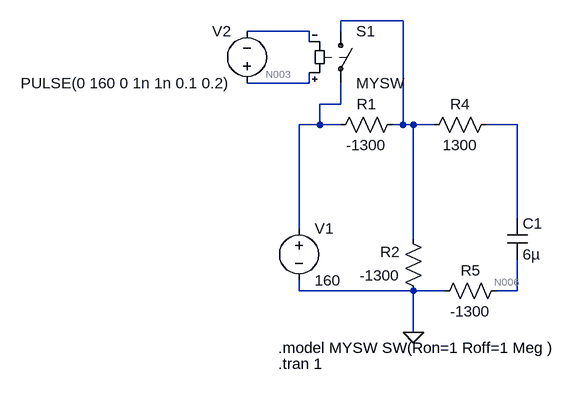
[diagram p0: schematic расчетная работа2.asc]
расчетная работа2.asc, the LTspice schematic file:
Version 4
SHEET 1 880 680
WIRE 176 -144 80 -144
WIRE 32 -128 -64 -128
WIRE 80 -128 80 -144
WIRE 32 -112 32 -128
WIRE 32 -48 32 -64
WIRE 32 -48 -64 -48
WIRE 80 -16 80 -48
WIRE 80 -16 48 -16
WIRE 48 16 48 -16
WIRE 48 16 16 16
WIRE 80 16 48 16
WIRE 176 16 176 -144
WIRE 176 16 160 16
WIRE 192 16 176 16
WIRE 224 16 192 16
WIRE 352 16 304 16
WIRE 352 160 352 16
WIRE 16 176 16 16
WIRE 192 192 192 16
WIRE 16 272 16 256
WIRE 192 272 16 272
WIRE 240 272 192 272
WIRE 352 272 352 224
WIRE 352 272 320 272
WIRE 192 336 192 272
FLAG 192 336 0
SYMBOL res 176 0 R90
WINDOW 0 0 56 VBottom 2
WINDOW 3 32 56 VTop 2
SYMATTR InstName R1
SYMATTR Value -1300
SYMBOL res 208 288 R180
WINDOW 0 36 76 Left 2
WINDOW 3 36 40 Left 2
SYMATTR InstName R2
SYMATTR Value -1300
SYMBOL res 208 32 R270
WINDOW 0 32 56 VTop 2
WINDOW 3 0 56 VBottom 2
SYMATTR InstName R4
SYMATTR Value 1300
SYMBOL res 224 288 R270
WINDOW 0 32 56 VTop 2
WINDOW 3 0 56 VBottom 2
SYMATTR InstName R5
SYMATTR Value -1300
SYMBOL cap 336 160 R0
SYMATTR InstName C1
SYMATTR Value 6µ
SYMBOL voltage 16 160 R0
SYMATTR InstName V1
SYMATTR Value 160
SYMBOL sw 80 -144 R0
SYMATTR InstName S1
SYMATTR Value MYSW
SYMBOL voltage -64 -32 R180
WINDOW 0 24 96 Left 2
WINDOW 3 24 16 Left 2
WINDOW 123 0 0 Left 0
WINDOW 39 0 0 Left 0
SYMATTR InstName V2
SYMATTR Value PULSE(0 160 0 1n 1n 0.1 0.2)
TEXT -16 360 Left 2 !.model MYSW SW(Ron=1 Roff=1 Meg )
TEXT -16 384 Left 2 !.tran 1

The netlist it stands for:
* расчетная работа2.asc
R1 N001 N004 -1300
R2 0 N001 -1300
R4 N001 N005 1300
R5 0 N006 -1300
C1 N005 N006 6µ
V1 N004 0 160
S1 N001 N004 N003 N002 MYSW
V2 N003 N002 PULSE(0 160 0 1n 1n 0.1 0.2)
.model MYSW SW(Ron=1 Roff=1 Meg )
.tran 1
.backanno
.end

* Results of the author's LTspice run, read from the files saved beside the schematic
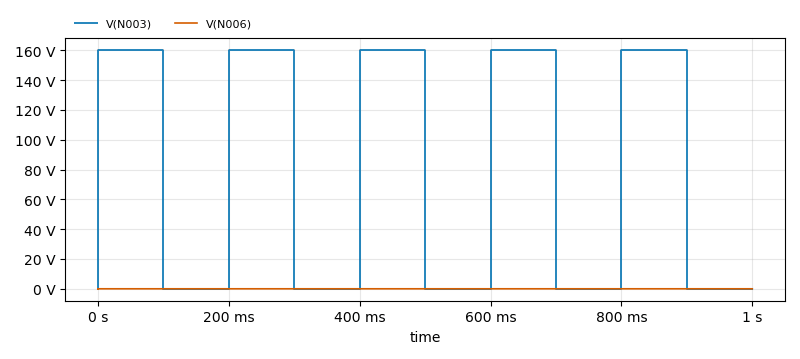
[diagram p1: Transient Analysis of расчетная работа2.asc, plotted from the saved traces]
* Transient Analysis, 1 run:
*   V(N003): min 0 V, max 160 V, average 80 V, rms 113.1 V, last 0 V
*   V(N006): min -10.3 mV, max 5.438 mV, average 36.94 nV, rms 2.472 µV, last 0 V